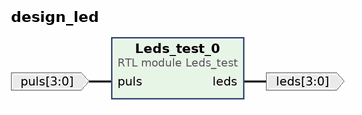
[diagram p0: block diagram of the top level]
# Vivado block design design_led, xck26-sfvc784-2LV-c, Vivado 2022.2
create_bd_design design_led

create_bd_port -dir I -from 3 -to 0 puls
create_bd_port -dir O -from 3 -to 0 leds

create_bd_cell -type module -reference Leds_test Leds_test_0

# ---- connections ----

connect_bd_net [get_bd_pins Leds_test_0/leds] [get_bd_ports leds]
connect_bd_net -net puls_0_1 [get_bd_ports puls] [get_bd_pins Leds_test_0/puls]

validate_bd_design
save_bd_design
